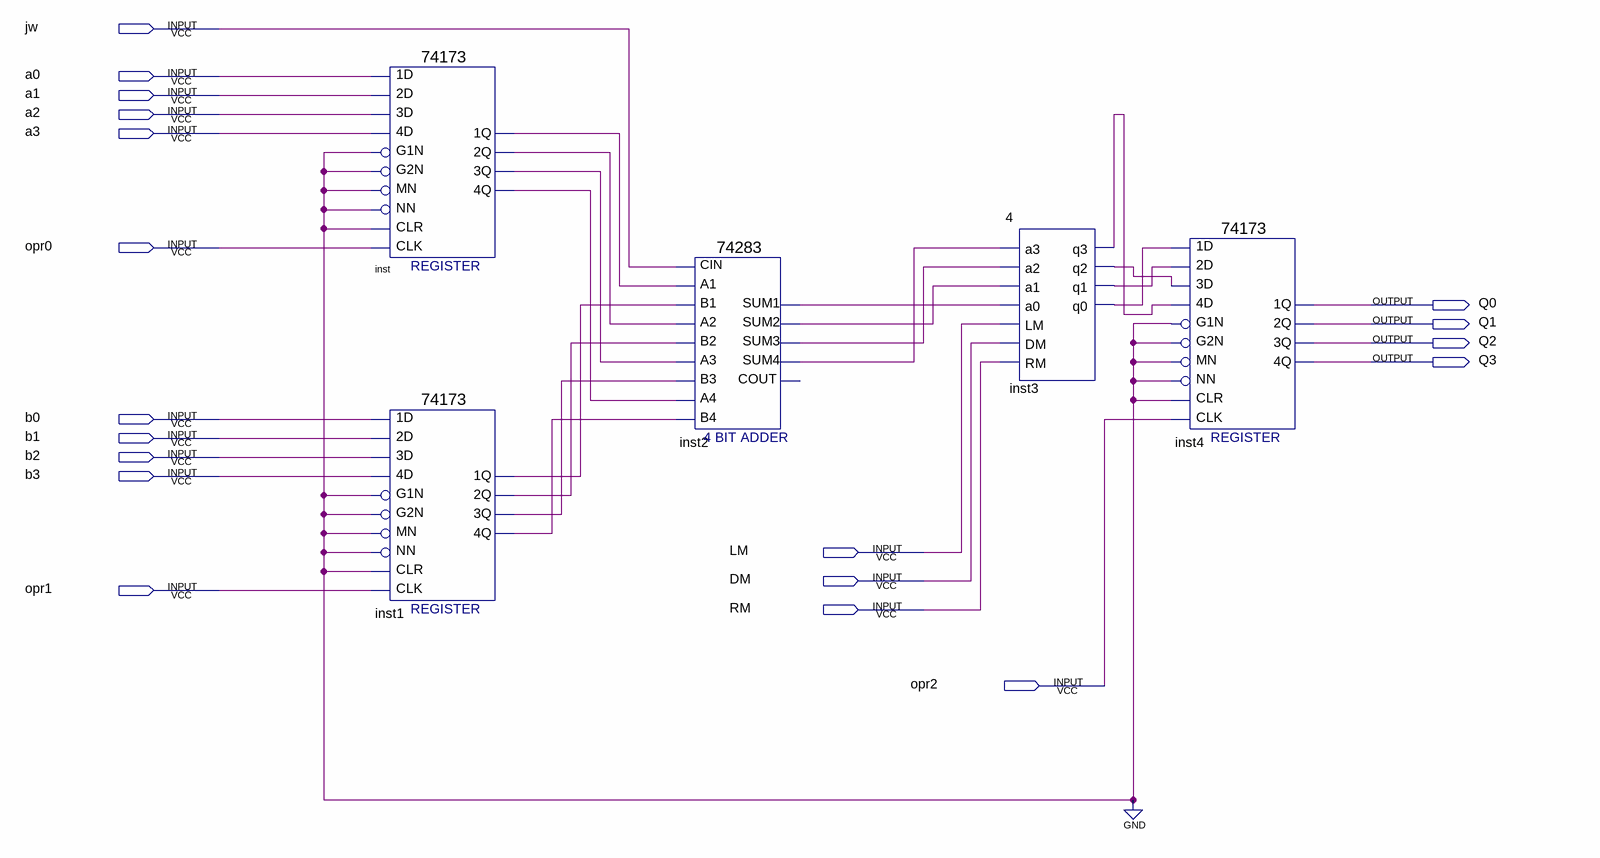
[diagram p0: schematic sheet]
// Quartus schematic 5.bdf as structural Verilog: 5 symbols, 19 pins
module \5  (
  input  jw,
  input  a0,
  input  a1,
  input  a2,
  input  a3,
  input  opr0,
  input  b0,
  input  b1,
  input  b2,
  input  b3,
  input  LM,
  input  DM,
  input  opr1,
  input  RM,
  input  opr2,
  output Q0,
  output Q1,
  output Q2,
  output Q3
);

  wire inst1_1q, inst1_2q, inst1_3q, inst1_4q, inst2_sum1, inst2_sum2, inst2_sum3, inst2_sum4, inst3_q0,
       inst3_q1, inst3_q2, inst3_q3, inst_1q, inst_2q, inst_3q, inst_4q;

  \74173  inst (
    .\3D (a2), .MN(1'b0), .\1D (a0), .\2D (a1), .\4D (a3), .G1N(1'b0), .G2N(1'b0), .NN(1'b0), .CLR(1'b0),
    .CLK(opr0), .\3Q (inst_3q), .\2Q (inst_2q), .\1Q (inst_1q), .\4Q (inst_4q));
  \74173  inst1 (
    .\3D (b2), .MN(1'b0), .\1D (b0), .\2D (b1), .\4D (b3), .G1N(1'b0), .G2N(1'b0), .NN(1'b0), .CLR(1'b0),
    .CLK(opr1), .\3Q (inst1_3q), .\2Q (inst1_2q), .\1Q (inst1_1q), .\4Q (inst1_4q));
  \74283  inst2 (
    .CIN(jw), .A1(inst_1q), .A2(inst_2q), .B2(inst1_2q), .A3(inst_3q), .A4(inst_4q), .B4(inst1_4q),
    .B1(inst1_1q), .B3(inst1_3q), .SUM4(inst2_sum4), .SUM1(inst2_sum1), .SUM2(inst2_sum2), .SUM3(inst2_sum3));  // open: COUT
  \4  inst3 (
    .a3(inst2_sum4), .a2(inst2_sum3), .a1(inst2_sum2), .a0(inst2_sum1), .LM(LM), .DM(DM), .RM(RM),
    .q3(inst3_q3), .q2(inst3_q2), .q1(inst3_q1), .q0(inst3_q0));
  \74173  inst4 (
    .\3D (inst3_q2), .MN(1'b0), .\1D (inst3_q0), .\2D (inst3_q1), .\4D (inst3_q3), .G1N(1'b0), .G2N(1'b0),
    .NN(1'b0), .CLR(1'b0), .CLK(opr2), .\3Q (Q2), .\2Q (Q1), .\1Q (Q0), .\4Q (Q3));
endmodule
